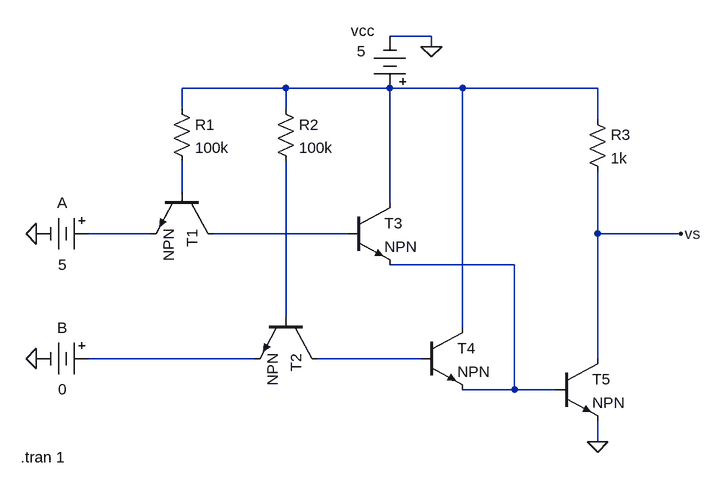
[diagram p0: schematic compuerta NOR.asc]
compuerta NOR.asc, the LTspice schematic file:
Version 4
SHEET 1 880 680
WIRE 432 -64 368 -64
WIRE 432 -48 432 -64
WIRE 208 16 48 16
WIRE 368 16 208 16
WIRE 480 16 368 16
WIRE 688 16 480 16
WIRE 48 48 48 16
WIRE 208 48 208 16
WIRE 688 64 688 16
WIRE 48 176 48 128
WIRE 368 192 368 16
WIRE 0 240 -96 240
WIRE 304 240 96 240
WIRE 688 240 688 144
WIRE 816 240 688 240
WIRE 560 288 368 288
WIRE 208 368 208 128
WIRE 480 384 480 16
WIRE 160 432 -96 432
WIRE 416 432 256 432
WIRE 688 432 688 240
WIRE 560 480 560 288
WIRE 560 480 480 480
WIRE 624 480 560 480
WIRE 688 560 688 528
FLAG 432 -48 0
FLAG -176 240 0
FLAG -176 432 0
FLAG 816 240 vs
FLAG 688 560 0
SYMBOL res 32 32 R0
SYMATTR InstName R1
SYMATTR Value 100k
SYMBOL res 192 32 R0
SYMATTR InstName R2
SYMATTR Value 100k
SYMBOL res 672 48 R0
SYMATTR InstName R3
SYMATTR Value 1k
SYMBOL npn 96 176 R90
SYMATTR InstName T1
SYMBOL npn 256 368 R90
SYMATTR InstName T2
SYMBOL npn 304 192 R0
SYMATTR InstName T3
SYMBOL npn 416 384 R0
SYMATTR InstName T4
SYMBOL npn 624 432 R0
SYMATTR InstName T5
SYMBOL Misc\\battery 368 32 R180
WINDOW 0 24 104 Left 2
WINDOW 3 37 73 Left 2
WINDOW 123 0 0 Left 0
WINDOW 39 0 0 Left 0
SYMATTR InstName vcc
SYMATTR Value 5
SYMBOL Misc\\battery -80 240 R90
WINDOW 0 -32 56 VBottom 2
WINDOW 3 32 56 VTop 2
WINDOW 123 0 0 Left 0
WINDOW 39 0 0 Left 0
SYMATTR InstName A
SYMATTR Value 5
SYMBOL Misc\\battery -80 432 R90
WINDOW 0 -32 56 VBottom 2
WINDOW 3 32 56 VTop 2
WINDOW 123 0 0 Left 0
WINDOW 39 0 0 Left 0
SYMATTR InstName B
SYMATTR Value 0
TEXT -200 584 Left 2 !.tran 1

The netlist it stands for:
* compuerta NOR.asc
R1 N001 N002 100k
R2 N001 N006 100k
R3 N001 vs 1k
Q§T1 N004 N002 N003 0 NPN
Q§T2 N008 N006 N007 0 NPN
Q§T3 N001 N004 N005 0 NPN
Q§T4 N001 N008 N005 0 NPN
Q§T5 vs N005 0 0 NPN
vcc N001 0 5
V§A N003 0 5
V§B N007 0 0
.model NPN NPN
.model PNP PNP
.lib standard.bjt
.tran 1
.backanno
.end